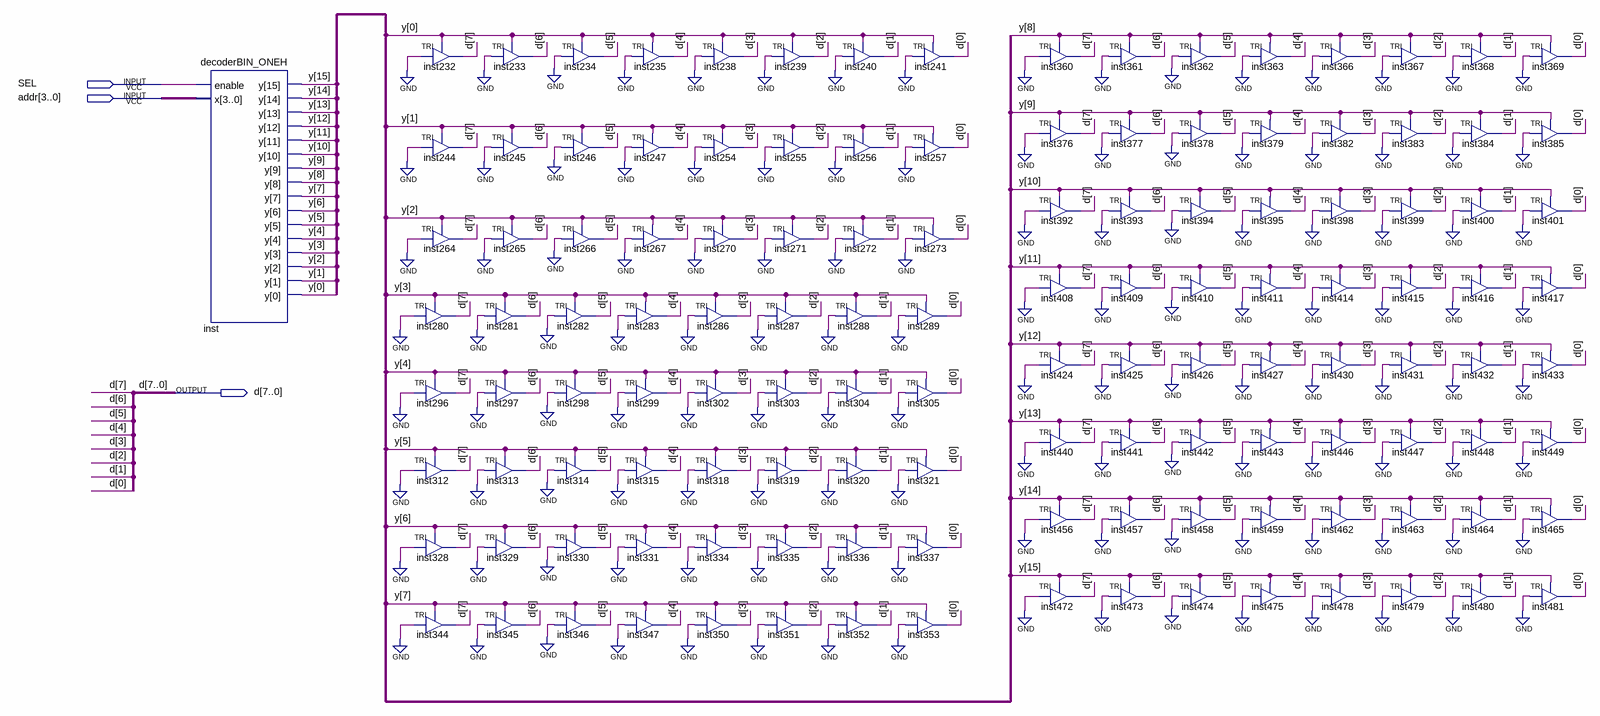
[diagram p0: schematic sheet]
// Quartus schematic rom16x8_zerada.bdf as structural Verilog: 129 symbols, 3 pins
module rom16x8_zerada (
  input  SEL,
  input  [3:0] addr,
  output [7:0] d
);

  wire [15:0] y;

  decoderBIN_ONEH inst (.enable(SEL), .x(addr), .y(y));
  TRI inst232 (.IN(1'b0), .OE(y[0]), .OUT(d[7]));
  TRI inst244 (.IN(1'b0), .OE(y[1]), .OUT(d[7]));
  TRI inst264 (.IN(1'b0), .OE(y[2]), .OUT(d[7]));
  TRI inst280 (.IN(1'b0), .OE(y[3]), .OUT(d[7]));
  TRI inst296 (.IN(1'b0), .OE(y[4]), .OUT(d[7]));
  TRI inst312 (.IN(1'b0), .OE(y[5]), .OUT(d[7]));
  TRI inst328 (.IN(1'b0), .OE(y[6]), .OUT(d[7]));
  TRI inst344 (.IN(1'b0), .OE(y[7]), .OUT(d[7]));
  TRI inst233 (.IN(1'b0), .OE(y[0]), .OUT(d[6]));
  TRI inst245 (.IN(1'b0), .OE(y[1]), .OUT(d[6]));
  TRI inst265 (.IN(1'b0), .OE(y[2]), .OUT(d[6]));
  TRI inst281 (.IN(1'b0), .OE(y[3]), .OUT(d[6]));
  TRI inst297 (.IN(1'b0), .OE(y[4]), .OUT(d[6]));
  TRI inst313 (.IN(1'b0), .OE(y[5]), .OUT(d[6]));
  TRI inst329 (.IN(1'b0), .OE(y[6]), .OUT(d[6]));
  TRI inst345 (.IN(1'b0), .OE(y[7]), .OUT(d[6]));
  TRI inst234 (.IN(1'b0), .OE(y[0]), .OUT(d[5]));
  TRI inst246 (.IN(1'b0), .OE(y[1]), .OUT(d[5]));
  TRI inst266 (.IN(1'b0), .OE(y[2]), .OUT(d[5]));
  TRI inst282 (.IN(1'b0), .OE(y[3]), .OUT(d[5]));
  TRI inst298 (.IN(1'b0), .OE(y[4]), .OUT(d[5]));
  TRI inst314 (.IN(1'b0), .OE(y[5]), .OUT(d[5]));
  TRI inst330 (.IN(1'b0), .OE(y[6]), .OUT(d[5]));
  TRI inst346 (.IN(1'b0), .OE(y[7]), .OUT(d[5]));
  TRI inst235 (.IN(1'b0), .OE(y[0]), .OUT(d[4]));
  TRI inst247 (.IN(1'b0), .OE(y[1]), .OUT(d[4]));
  TRI inst267 (.IN(1'b0), .OE(y[2]), .OUT(d[4]));
  TRI inst283 (.IN(1'b0), .OE(y[3]), .OUT(d[4]));
  TRI inst299 (.IN(1'b0), .OE(y[4]), .OUT(d[4]));
  TRI inst315 (.IN(1'b0), .OE(y[5]), .OUT(d[4]));
  TRI inst331 (.IN(1'b0), .OE(y[6]), .OUT(d[4]));
  TRI inst347 (.IN(1'b0), .OE(y[7]), .OUT(d[4]));
  TRI inst238 (.IN(1'b0), .OE(y[0]), .OUT(d[3]));
  TRI inst254 (.IN(1'b0), .OE(y[1]), .OUT(d[3]));
  TRI inst270 (.IN(1'b0), .OE(y[2]), .OUT(d[3]));
  TRI inst286 (.IN(1'b0), .OE(y[3]), .OUT(d[3]));
  TRI inst302 (.IN(1'b0), .OE(y[4]), .OUT(d[3]));
  TRI inst318 (.IN(1'b0), .OE(y[5]), .OUT(d[3]));
  TRI inst334 (.IN(1'b0), .OE(y[6]), .OUT(d[3]));
  TRI inst350 (.IN(1'b0), .OE(y[7]), .OUT(d[3]));
  TRI inst239 (.IN(1'b0), .OE(y[0]), .OUT(d[2]));
  TRI inst255 (.IN(1'b0), .OE(y[1]), .OUT(d[2]));
  TRI inst271 (.IN(1'b0), .OE(y[2]), .OUT(d[2]));
  TRI inst287 (.IN(1'b0), .OE(y[3]), .OUT(d[2]));
  TRI inst303 (.IN(1'b0), .OE(y[4]), .OUT(d[2]));
  TRI inst319 (.IN(1'b0), .OE(y[5]), .OUT(d[2]));
  TRI inst335 (.IN(1'b0), .OE(y[6]), .OUT(d[2]));
  TRI inst351 (.IN(1'b0), .OE(y[7]), .OUT(d[2]));
  TRI inst240 (.IN(1'b0), .OE(y[0]), .OUT(d[1]));
  TRI inst256 (.IN(1'b0), .OE(y[1]), .OUT(d[1]));
  TRI inst272 (.IN(1'b0), .OE(y[2]), .OUT(d[1]));
  TRI inst288 (.IN(1'b0), .OE(y[3]), .OUT(d[1]));
  TRI inst304 (.IN(1'b0), .OE(y[4]), .OUT(d[1]));
  TRI inst320 (.IN(1'b0), .OE(y[5]), .OUT(d[1]));
  TRI inst336 (.IN(1'b0), .OE(y[6]), .OUT(d[1]));
  TRI inst352 (.IN(1'b0), .OE(y[7]), .OUT(d[1]));
  TRI inst241 (.IN(1'b0), .OE(y[0]), .OUT(d[0]));
  TRI inst257 (.IN(1'b0), .OE(y[1]), .OUT(d[0]));
  TRI inst273 (.IN(1'b0), .OE(y[2]), .OUT(d[0]));
  TRI inst289 (.IN(1'b0), .OE(y[3]), .OUT(d[0]));
  TRI inst305 (.IN(1'b0), .OE(y[4]), .OUT(d[0]));
  TRI inst321 (.IN(1'b0), .OE(y[5]), .OUT(d[0]));
  TRI inst337 (.IN(1'b0), .OE(y[6]), .OUT(d[0]));
  TRI inst353 (.IN(1'b0), .OE(y[7]), .OUT(d[0]));
  TRI inst360 (.IN(1'b0), .OE(y[8]), .OUT(d[7]));
  TRI inst376 (.IN(1'b0), .OE(y[9]), .OUT(d[7]));
  TRI inst392 (.IN(1'b0), .OE(y[10]), .OUT(d[7]));
  TRI inst408 (.IN(1'b0), .OE(y[11]), .OUT(d[7]));
  TRI inst424 (.IN(1'b0), .OE(y[12]), .OUT(d[7]));
  TRI inst440 (.IN(1'b0), .OE(y[13]), .OUT(d[7]));
  TRI inst456 (.IN(1'b0), .OE(y[14]), .OUT(d[7]));
  TRI inst472 (.IN(1'b0), .OE(y[15]), .OUT(d[7]));
  TRI inst361 (.IN(1'b0), .OE(y[8]), .OUT(d[6]));
  TRI inst377 (.IN(1'b0), .OE(y[9]), .OUT(d[6]));
  TRI inst393 (.IN(1'b0), .OE(y[10]), .OUT(d[6]));
  TRI inst409 (.IN(1'b0), .OE(y[11]), .OUT(d[6]));
  TRI inst425 (.IN(1'b0), .OE(y[12]), .OUT(d[6]));
  TRI inst441 (.IN(1'b0), .OE(y[13]), .OUT(d[6]));
  TRI inst457 (.IN(1'b0), .OE(y[14]), .OUT(d[6]));
  TRI inst473 (.IN(1'b0), .OE(y[15]), .OUT(d[6]));
  TRI inst362 (.IN(1'b0), .OE(y[8]), .OUT(d[5]));
  TRI inst378 (.IN(1'b0), .OE(y[9]), .OUT(d[5]));
  TRI inst394 (.IN(1'b0), .OE(y[10]), .OUT(d[5]));
  TRI inst410 (.IN(1'b0), .OE(y[11]), .OUT(d[5]));
  TRI inst426 (.IN(1'b0), .OE(y[12]), .OUT(d[5]));
  TRI inst442 (.IN(1'b0), .OE(y[13]), .OUT(d[5]));
  TRI inst458 (.IN(1'b0), .OE(y[14]), .OUT(d[5]));
  TRI inst474 (.IN(1'b0), .OE(y[15]), .OUT(d[5]));
  TRI inst363 (.IN(1'b0), .OE(y[8]), .OUT(d[4]));
  TRI inst379 (.IN(1'b0), .OE(y[9]), .OUT(d[4]));
  TRI inst395 (.IN(1'b0), .OE(y[10]), .OUT(d[4]));
  TRI inst411 (.IN(1'b0), .OE(y[11]), .OUT(d[4]));
  TRI inst427 (.IN(1'b0), .OE(y[12]), .OUT(d[4]));
  TRI inst443 (.IN(1'b0), .OE(y[13]), .OUT(d[4]));
  TRI inst459 (.IN(1'b0), .OE(y[14]), .OUT(d[4]));
  TRI inst475 (.IN(1'b0), .OE(y[15]), .OUT(d[4]));
  TRI inst366 (.IN(1'b0), .OE(y[8]), .OUT(d[3]));
  TRI inst382 (.IN(1'b0), .OE(y[9]), .OUT(d[3]));
  TRI inst398 (.IN(1'b0), .OE(y[10]), .OUT(d[3]));
  TRI inst414 (.IN(1'b0), .OE(y[11]), .OUT(d[3]));
  TRI inst430 (.IN(1'b0), .OE(y[12]), .OUT(d[3]));
  TRI inst446 (.IN(1'b0), .OE(y[13]), .OUT(d[3]));
  TRI inst462 (.IN(1'b0), .OE(y[14]), .OUT(d[3]));
  TRI inst478 (.IN(1'b0), .OE(y[15]), .OUT(d[3]));
  TRI inst367 (.IN(1'b0), .OE(y[8]), .OUT(d[2]));
  TRI inst383 (.IN(1'b0), .OE(y[9]), .OUT(d[2]));
  TRI inst399 (.IN(1'b0), .OE(y[10]), .OUT(d[2]));
  TRI inst415 (.IN(1'b0), .OE(y[11]), .OUT(d[2]));
  TRI inst431 (.IN(1'b0), .OE(y[12]), .OUT(d[2]));
  TRI inst447 (.IN(1'b0), .OE(y[13]), .OUT(d[2]));
  TRI inst463 (.IN(1'b0), .OE(y[14]), .OUT(d[2]));
  TRI inst479 (.IN(1'b0), .OE(y[15]), .OUT(d[2]));
  TRI inst368 (.IN(1'b0), .OE(y[8]), .OUT(d[1]));
  TRI inst384 (.IN(1'b0), .OE(y[9]), .OUT(d[1]));
  TRI inst400 (.IN(1'b0), .OE(y[10]), .OUT(d[1]));
  TRI inst416 (.IN(1'b0), .OE(y[11]), .OUT(d[1]));
  TRI inst432 (.IN(1'b0), .OE(y[12]), .OUT(d[1]));
  TRI inst448 (.IN(1'b0), .OE(y[13]), .OUT(d[1]));
  TRI inst464 (.IN(1'b0), .OE(y[14]), .OUT(d[1]));
  TRI inst480 (.IN(1'b0), .OE(y[15]), .OUT(d[1]));
  TRI inst369 (.IN(1'b0), .OE(y[8]), .OUT(d[0]));
  TRI inst385 (.IN(1'b0), .OE(y[9]), .OUT(d[0]));
  TRI inst401 (.IN(1'b0), .OE(y[10]), .OUT(d[0]));
  TRI inst417 (.IN(1'b0), .OE(y[11]), .OUT(d[0]));
  TRI inst433 (.IN(1'b0), .OE(y[12]), .OUT(d[0]));
  TRI inst449 (.IN(1'b0), .OE(y[13]), .OUT(d[0]));
  TRI inst465 (.IN(1'b0), .OE(y[14]), .OUT(d[0]));
  TRI inst481 (.IN(1'b0), .OE(y[15]), .OUT(d[0]));
endmodule
